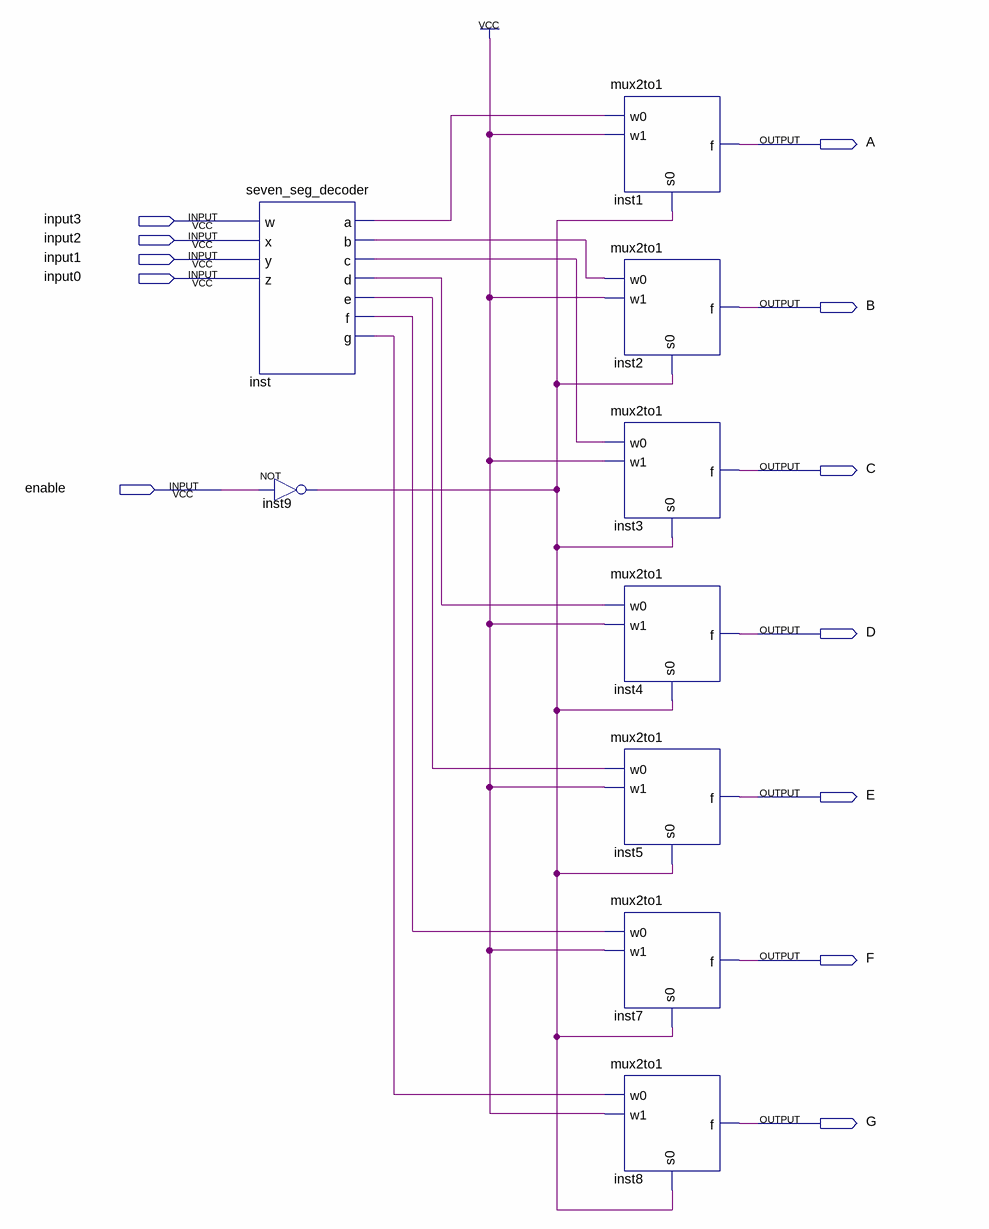
[diagram p0: schematic sheet]
// Quartus schematic sevenSegEnable.bdf as structural Verilog: 9 symbols, 12 pins
module sevenSegEnable (
  input  input3,
  input  input2,
  input  input1,
  input  input0,
  input  enable,
  output A,
  output B,
  output C,
  output D,
  output E,
  output F,
  output G
);

  wire inst9_out, inst_a, inst_b, inst_c, inst_d, inst_e, inst_f, inst_g;

  seven_seg_decoder inst (
    .w(input3), .x(input2), .y(input1), .z(input0), .a(inst_a), .b(inst_b), .c(inst_c), .d(inst_d),
    .e(inst_e), .f(inst_f), .g(inst_g));
  not inst9 (inst9_out, enable);
  mux2to1 inst1 (.w1(1'b1), .w0(inst_a), .s0(inst9_out), .f(A));
  mux2to1 inst2 (.w1(1'b1), .w0(inst_b), .s0(inst9_out), .f(B));
  mux2to1 inst3 (.w1(1'b1), .w0(inst_c), .s0(inst9_out), .f(C));
  mux2to1 inst4 (.w1(1'b1), .w0(inst_d), .s0(inst9_out), .f(D));
  mux2to1 inst5 (.w1(1'b1), .w0(inst_e), .s0(inst9_out), .f(E));
  mux2to1 inst7 (.w1(1'b1), .w0(inst_f), .s0(inst9_out), .f(F));
  mux2to1 inst8 (.w1(1'b1), .w0(inst_g), .s0(inst9_out), .f(G));
endmodule
